# Altium schematic sheet power.SchDoc
size A3
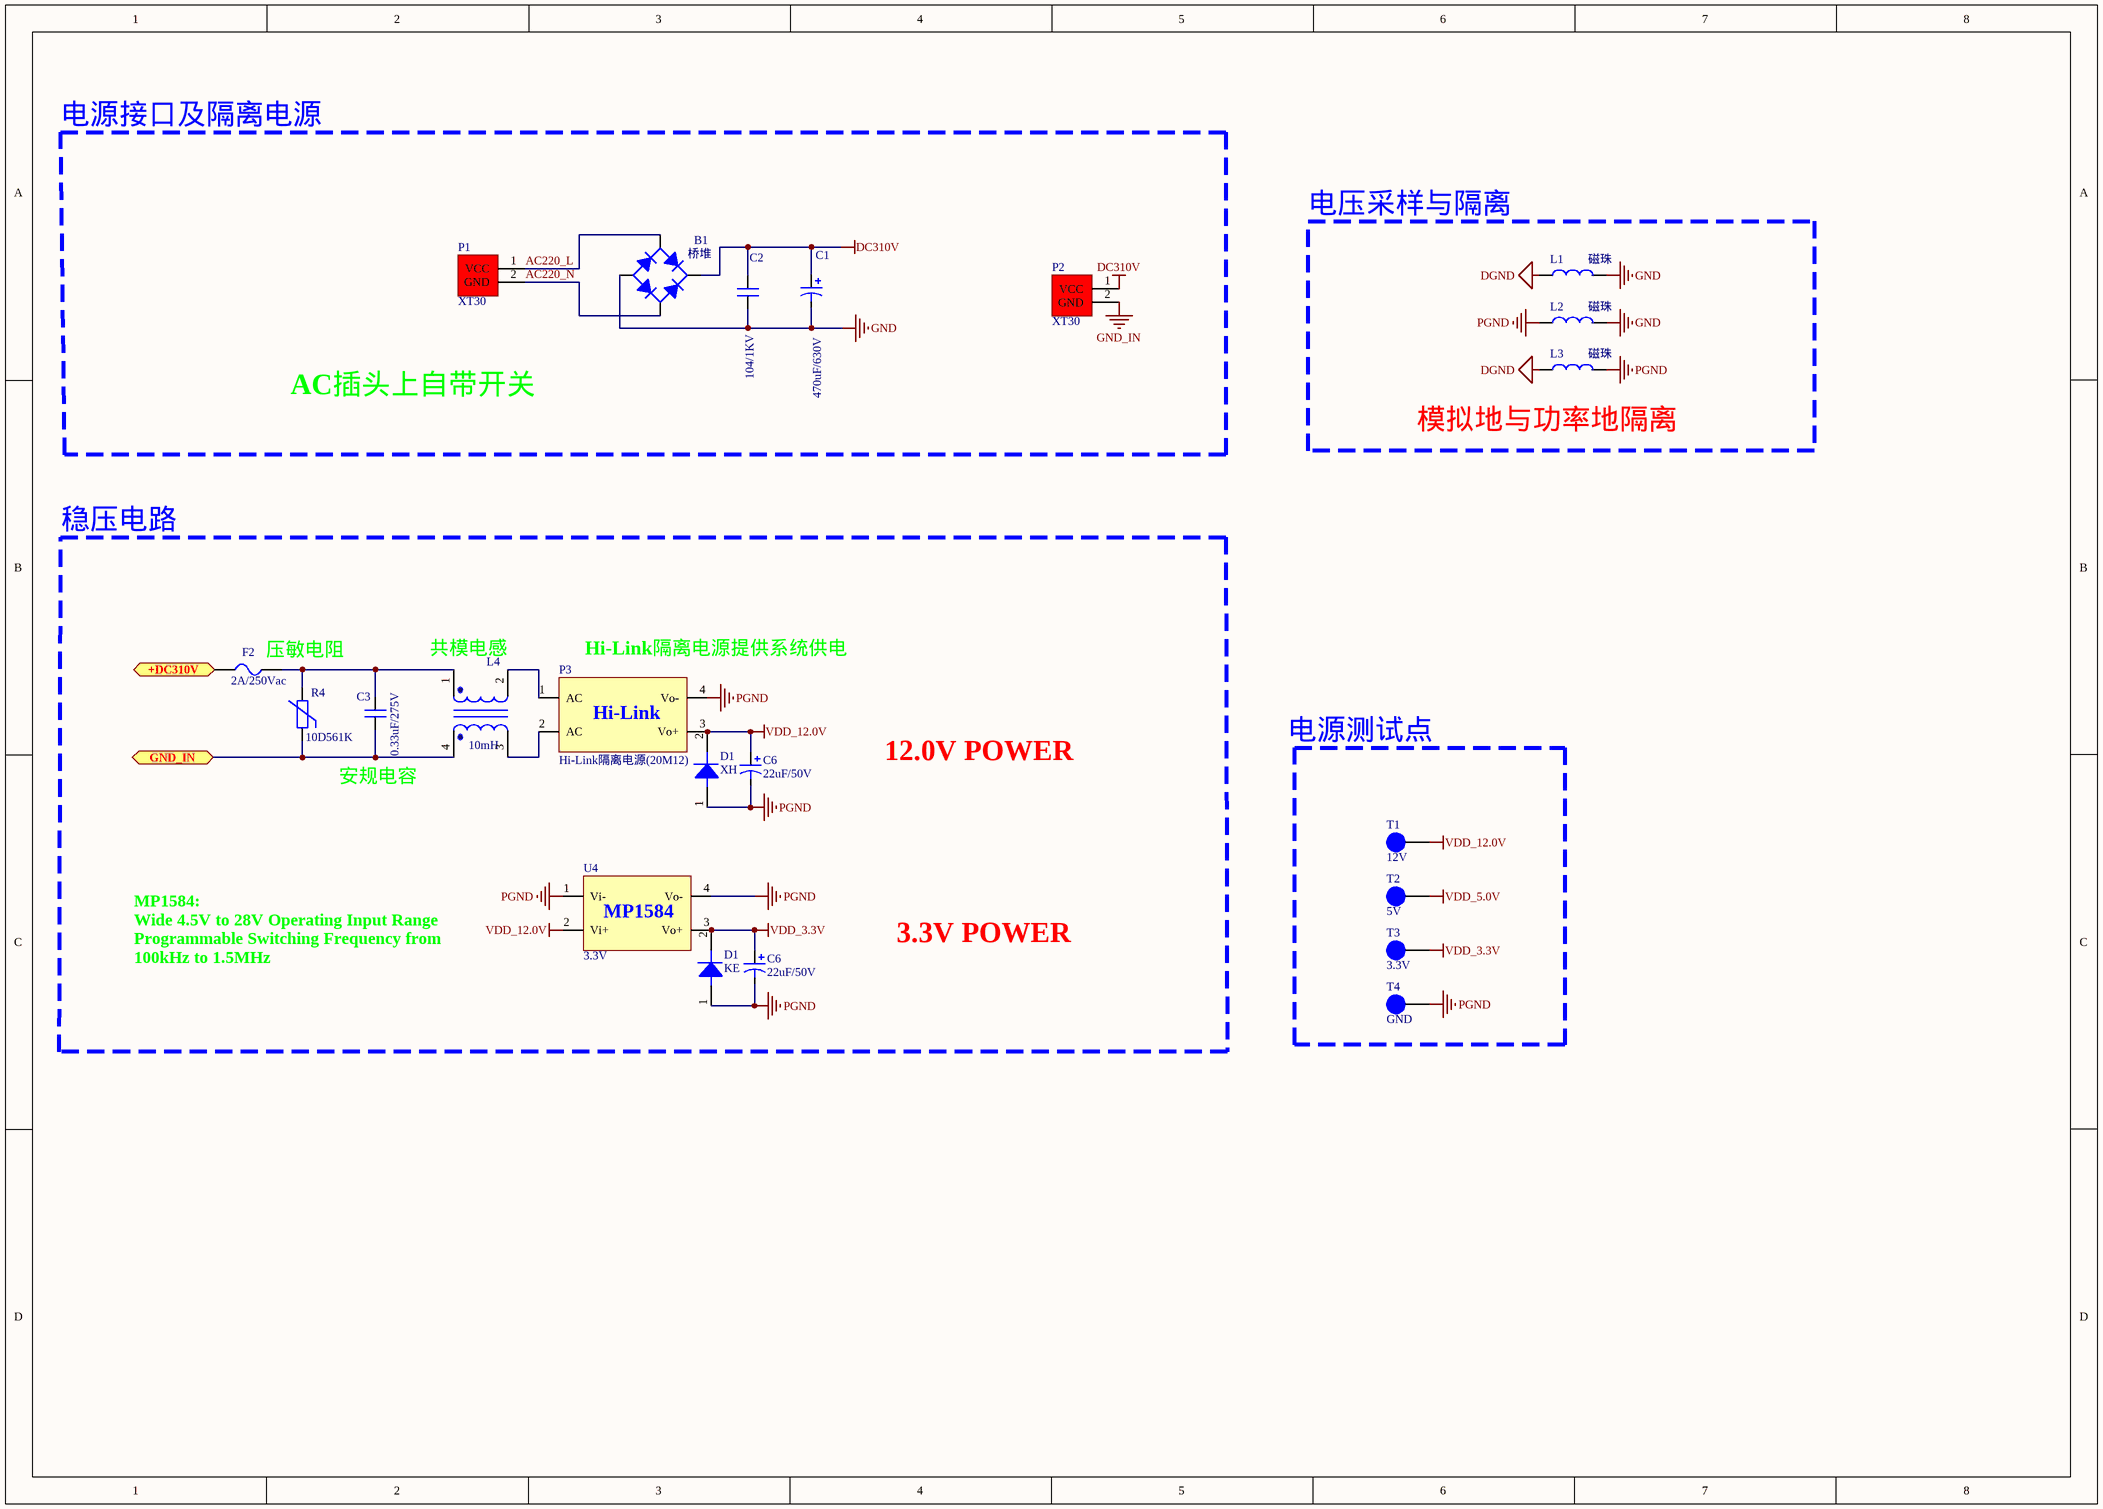
[diagram p0: power.SchDoc]

## Parts
(Parts that share a designator on the sheet are numbered #1, #2 ... from top to bottom, then left to right.)
B1  桥堆
C1  470uF/630V  [RB.3.6]
C2  104/1KV  [无极性直插电容]
C3  0.33uF/275V  [CX 15*18*11]
C6#1  22uF/50V  [CM D(6.3*5.4)]
C6#2  22uF/50V  [CM D(6.3*5.4)]
D1#1  XH  [SMA]
D1#2  KE  [SMA]
F2  2A/250Vac  [FU 5x20]
L1  磁珠  [1206L]
L2  磁珠  [1206L]
L3  磁珠  [1206L]
L4  10mH  [T12x6x4]
P1  XT30  [XT30PW-F]
P2  XT30  [XT30PW-F]
P3  Hi-Link隔离电源(20M12)  [HLK-20M24]
R4  10D561K  [VDR 10D-4.5]
T1  12V  [HEADER 1]
T2  5V  [HEADER 1]
T3  3.3V  [HEADER 1]
T4  GND  [HEADER 1]
U4  3.3V  [MP1584电源模块]

## Ports
+DC310V, GND_IN

## Nets
DC310V: B1.DC+ C1.1 C2.2 P2.1(VCC)
DGND: L1.1 L3.1
GND: B1.DC- C1.2 C2.1 L1.2 L2.2
GND_IN: P2.2(GND)
PGND: C6#1.2 C6#2.2 D1#1.1 D1#2.1 L2.1 L3.2 P3.4(Vo-) T4.1 U4.1(Vi-) U4.4(Vo-)
VDD_3.3V: C6#2.1 D1#2.2 T3.1 U4.3(Vo+)
VDD_5.0V: T2.1
VDD_12.0V: C6#1.1 D1#1.2 P3.3(Vo+) T1.1 U4.2(Vi+)
+DC310V: F2.1 ; port +DC310V
AC220_L: B1.AC1 P1.1(VCC)
AC220_N: B1.AC2 P1.2(GND)
GND_IN: C3.1 L4.4 R4.1 ; port GND_IN  [a separate net that carries the same name]
NetC3_2: C3.2 F2.2 L4.1 R4.2
NetL4_2: L4.2 P3.1(AC)
NetL4_3: L4.3 P3.2(AC)

## Notes on the sheet
- 电源接口及隔离电源
- 电压采样与隔离
- AC插头上自带开关
- (near L3) 模拟地与功率地隔离
- 稳压电路
- (near F2) 压敏电阻
- (near L4) 共模电感
- (near P3) Hi-Link隔离电源提供系统供电
- 安规电容
- 12.0V POWER
- 电源测试点
- MP1584:
  Wide 4.5V to 28V Operating Input Range
  Programmable Switching Frequency from
  100kHz to 1.5MHz
- 3.3V POWER
- (in symbol HILINK-24V) Hi-Link
- (in symbol MP1584电源模块) MP1584

## Library data of the parts
C1 C6#1 C6#2 = Cap3: 直插极性电容
C2 = Cap2: 无极直插电容
C3 = Cap2: 安规电容
D1#1 D1#2 = Diode: 二极管
F2 = Fuse: 保险丝
L1-L3 = L: 电感
L4 = 共模电感
P1 P2 = 电源端子
P3 = HILINK-24V
R4 = 压敏电阻
T1-T4 = 测试点
U4 = MP1584电源模块